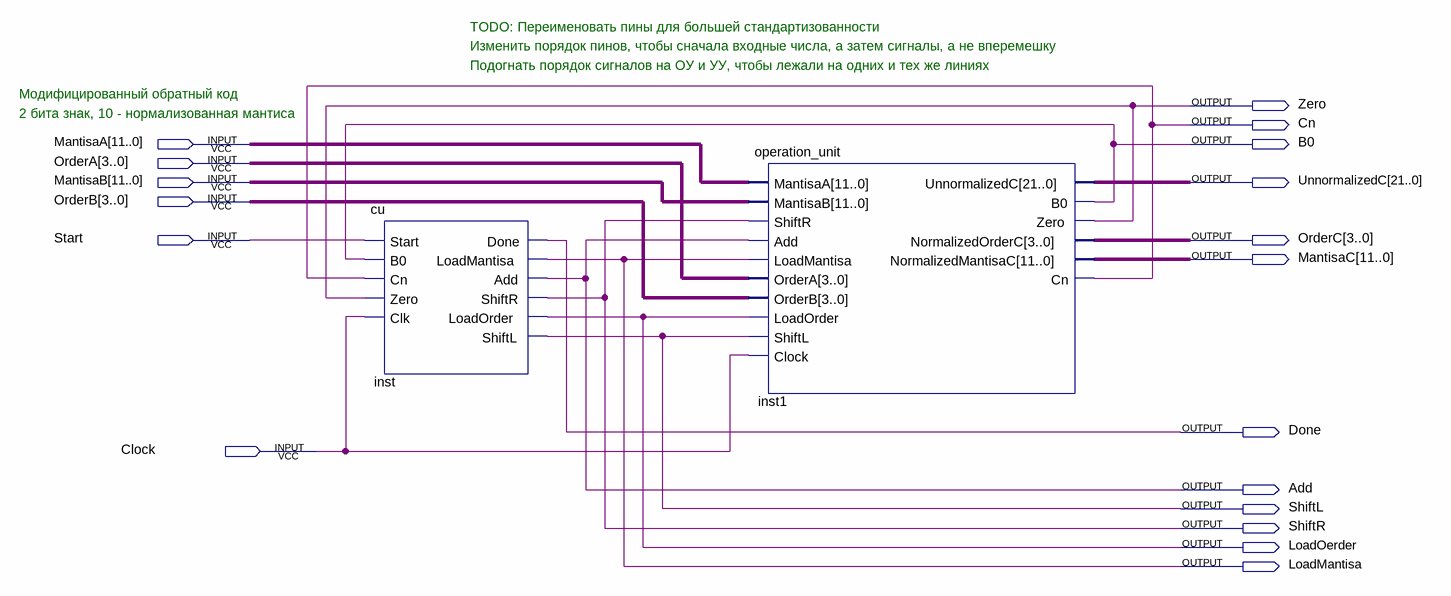
[diagram p0: schematic sheet]
// Quartus schematic AUTOMATA.bdf as structural Verilog: 2 symbols, 18 pins
module AUTOMATA (
  input  [11:0] MantisaA,
  input  [3:0] OrderA,
  input  [11:0] MantisaB,
  input  [3:0] OrderB,
  input  Start,
  input  Clock,
  output Zero,
  output Cn,
  output B0,
  output [21:0] UnnormalizedC,
  output [3:0] OrderC,
  output [11:0] MantisaC,
  output Done,
  output Add,
  output ShiftL,
  output ShiftR,
  output LoadOerder,
  output LoadMantisa
);

  cu inst (
    .Start(Start), .B0(B0), .Cn(Cn), .Zero(Zero), .Clk(Clock), .Done(Done), .LoadMantisa(LoadMantisa),
    .Add(Add), .ShiftR(ShiftR), .LoadOrder(LoadOerder), .ShiftL(ShiftL));
  operation_unit inst1 (
    .MantisaA(MantisaA), .MantisaB(MantisaB), .ShiftR(ShiftR), .Add(Add), .LoadMantisa(LoadMantisa),
    .OrderA(OrderA), .OrderB(OrderB), .LoadOrder(LoadOerder), .ShiftL(ShiftL), .Clock(Clock),
    .UnnormalizedC(UnnormalizedC), .B0(B0), .Zero(Zero), .NormalizedOrderC(OrderC),
    .NormalizedMantisaC(MantisaC), .Cn(Cn));

  // Notes on the sheet:
  //   TODO: Переименовать пины для большей стандартизованности
  //   Изменить порядок пинов, чтобы сначала входные числа, а затем сигналы, а не вперемешку
  //   Подогнать порядок сигналов на ОУ и УУ, чтобы лежали на одних и тех же линиях
  //   Модифицированный обратный код
  //   2 бита знак, 10 - нормализованная мантиса
endmodule
